# Altium schematic sheet cpu.SchDoc
size A4
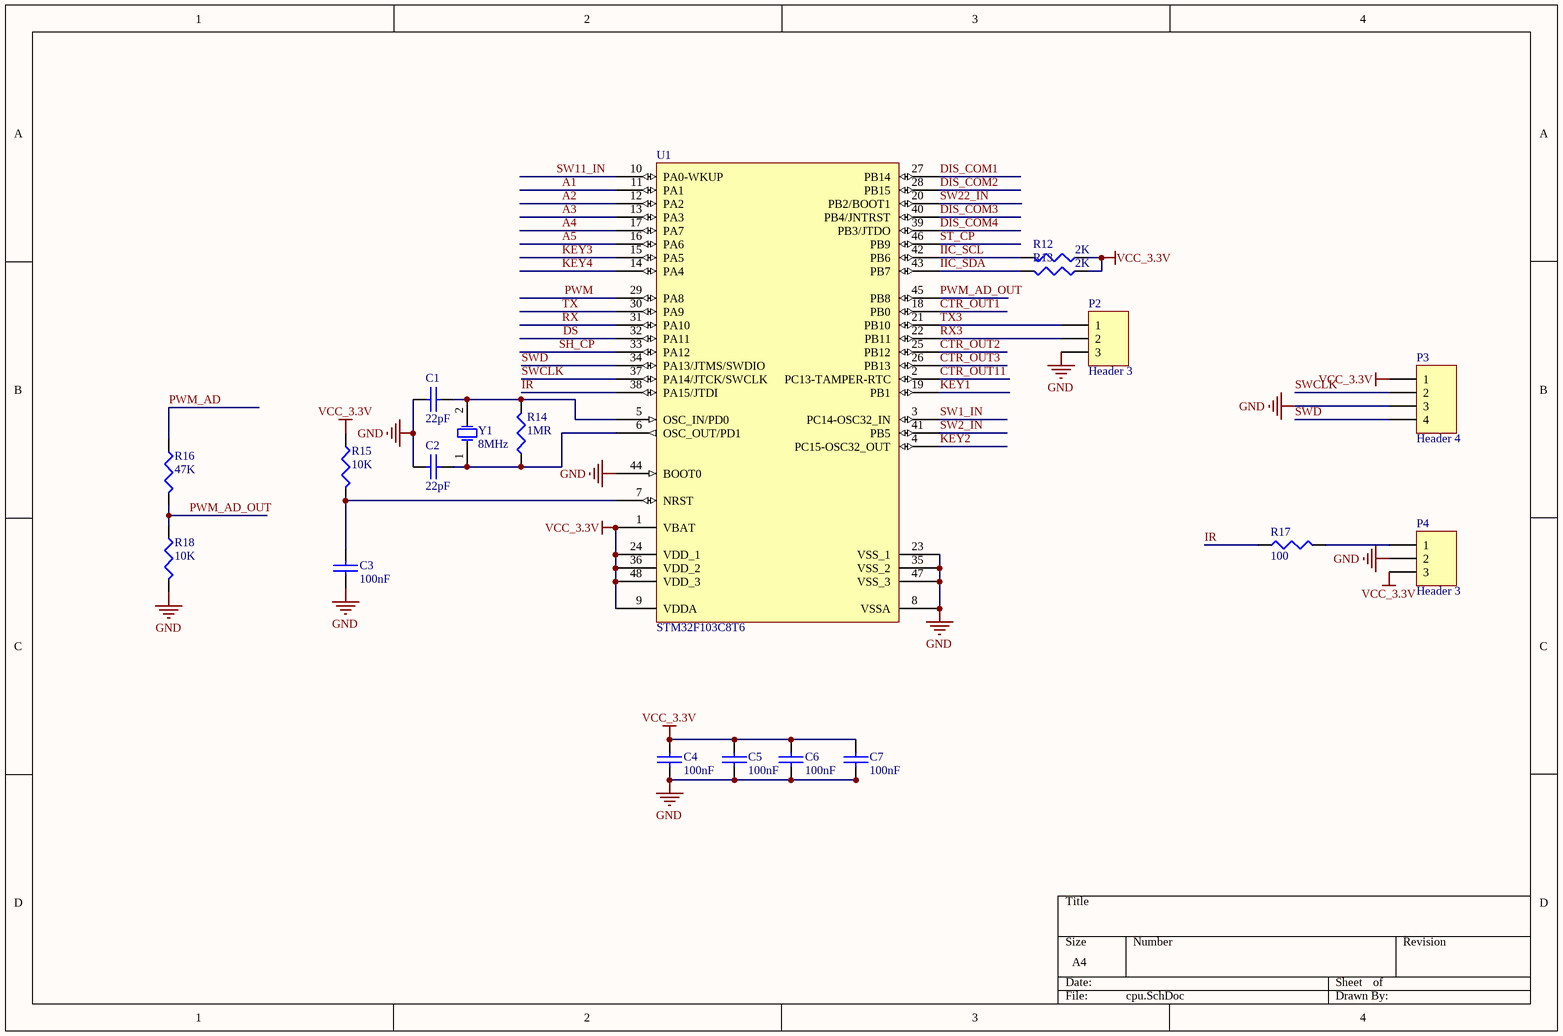
[diagram p0: cpu.SchDoc]

## Parts
C1  22pF  [0805c]
C2  22pF  [0805c]
C3  100nF  [0805c]
C4  100nF  [0805c]
C5  100nF  [0805c]
C6  100nF  [0805c]
C7  100nF  [0805c]
P2  Header 3  [HDR1X3]
P3  Header 4  [HDR1X4]
P4  Header 3  [HDR1X3]
R12  2K  [0805R]
R13  2K  [0805R]
R14  1MR  [0805R]
R15  10K  [0805R]
R16  47K  [0805R]
R17  100  [0805R]
R18  10K  [0805R]
U1  STM32F103C8T6  [TQFP-48]
Y1  8MHz  [SMT5032]

## Nets
GND: C1.1 C2.1 C3.1 C4.1 C5.1 C6.1 C7.1 P2.3 P3.3 P4.2 R18.2 U1.8(VSSA) U1.23(VSS_1) U1.35(VSS_2) U1.44(BOOT0) U1.47(VSS_3)
VCC_3.3V: C4.2 C5.2 C6.2 C7.2 P3.1 P4.3 R12.1 R13.1 R15.1 U1.1(VBAT) U1.9(VDDA) U1.24(VDD_1) U1.36(VDD_2) U1.48(VDD_3)
A1: U1.11(PA1)
A2: U1.12(PA2)
A3: U1.13(PA3)
A4: U1.17(PA7)
A5: U1.16(PA6)
CTR_OUT1: U1.18(PB0)
CTR_OUT2: U1.25(PB12)
CTR_OUT3: U1.26(PB13)
CTR_OUT11: U1.2(PC13-TAMPER-RTC)
DIS_COM1: U1.27(PB14)
DIS_COM2: U1.28(PB15)
DIS_COM3: U1.40(PB4/JNTRST)
DIS_COM4: U1.39(PB3/JTDO)
DS: U1.32(PA11)
IIC_SCL: R12.2 U1.42(PB6)
IIC_SDA: R13.2 U1.43(PB7)
IR: R17.1 U1.38(PA15/JTDI)
KEY1: U1.19(PB1)
KEY2: U1.4(PC15-OSC32_OUT)
KEY3: U1.15(PA5)
KEY4: U1.14(PA4)
PWM: U1.29(PA8)
PWM_AD: R16.1
PWM_AD_OUT: R16.2 R18.1 U1.45(PB8)
RX: U1.31(PA10)
RX3: P2.2 U1.22(PB11)
SH_CP: U1.33(PA12)
ST_CP: U1.46(PB9)
SW1_IN: U1.3(PC14-OSC32_IN)
SW2_IN: U1.41(PB5)
SW11_IN: U1.10(PA0-WKUP)
SW22_IN: U1.20(PB2/BOOT1)
SWCLK: P3.2 U1.37(PA14/JTCK/SWCLK)
SWD: P3.4 U1.34(PA13/JTMS/SWDIO)
TX: U1.30(PA9)
TX3: P2.1 U1.21(PB10)
NetC1_2: C1.2 R14.2 U1.5(OSC_IN/PD0) Y1.2(OSC2)
NetC2_2: C2.2 R14.1 U1.6(OSC_OUT/PD1) Y1.1(OSC1)
NetC3_2: C3.2 R15.2 U1.7(NRST)
NetP4_1: P4.1 R17.2

## Library data of the parts
C1-C7 = CAP: Capacitor
P2 P4 = Header 3: Header, 3-Pin; LatestRevisionDate: 17-Jul-2002; LatestRevisionNote: Re-released for DXP Platform.; Publisher: Altium Limited
P3 = Header 4: Header, 4-Pin; LatestRevisionDate: 17-Jul-2002; LatestRevisionNote: Re-released for DXP Platform.; Publisher: Altium Limited
R12-R18 = Res3: Resistor; Published: 8-Jun-2000; LatestRevisionDate: 29-May-2009; LatestRevisionNote: IPC-7351 Footprint Added.; PackageReference: J1-0603; Publisher: Altium Limited; PackageDescription: Chip Resistor
U1 = STM32F103C8T6: STM32 ARM-based 32-bit MCU with 64 Kbytes Flash, 48-pin LQFP, Industrial Temperature; Published: 30-May-2008; DatasheetVersion: rev6, Mar-2008; PackageVersion: Mar-2008; PackageReference: LQFP48; Publisher: Altium Limited; PackageDescription: 48-Pin Low-Profile Quad Flat Pack, 7 x 7 mm Body, 0.5 mm Pitch (LQFP48); ComponentLink1Description: Manufacturer Link; ComponentLink1URL: www.st.com/stm32; ComponentLink2Description: Datasheet; ComponentLink2URL: http://www.st.com/stonline/products/literature/ds/13587.pdf
Y1 = XTAL: Crystal Oscillator; Published: 8-Jun-2000; LatestRevisionDate: 17-Jul-2002; LatestRevisionNote: Re-released for DXP Platform.; PackageReference: R38; Publisher: Altium Limited; PackageDescription: Crystal, Thru-Hole; 2 Leads; Body 3.1 x 8.2 mm (Dia.xH)